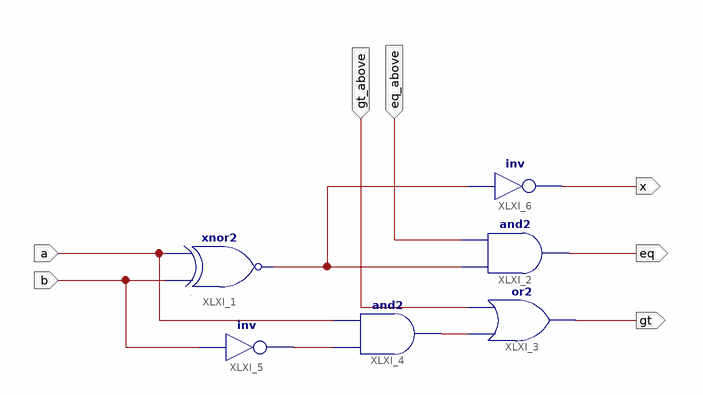
[diagram p0: schematic sheet 1]
// Xilinx ISE schematic cmp_1bit.sch (aspartan6) as structural Verilog: 6 symbols, 7 ports
module cmp_1bit (
  input  a,
  input  b,
  input  eq_above,
  input  gt_above,
  output eq,
  output gt,
  output x
);

  wire XLXN_3, XLXN_8, XLXN_9;

  xnor XLXI_1 (XLXN_3, b, a);
  and XLXI_2 (eq, XLXN_3, eq_above);
  or XLXI_3 (gt, XLXN_8, gt_above);
  and XLXI_4 (XLXN_8, XLXN_9, a);
  not XLXI_5 (XLXN_9, b);
  not XLXI_6 (x, XLXN_3);
endmodule
